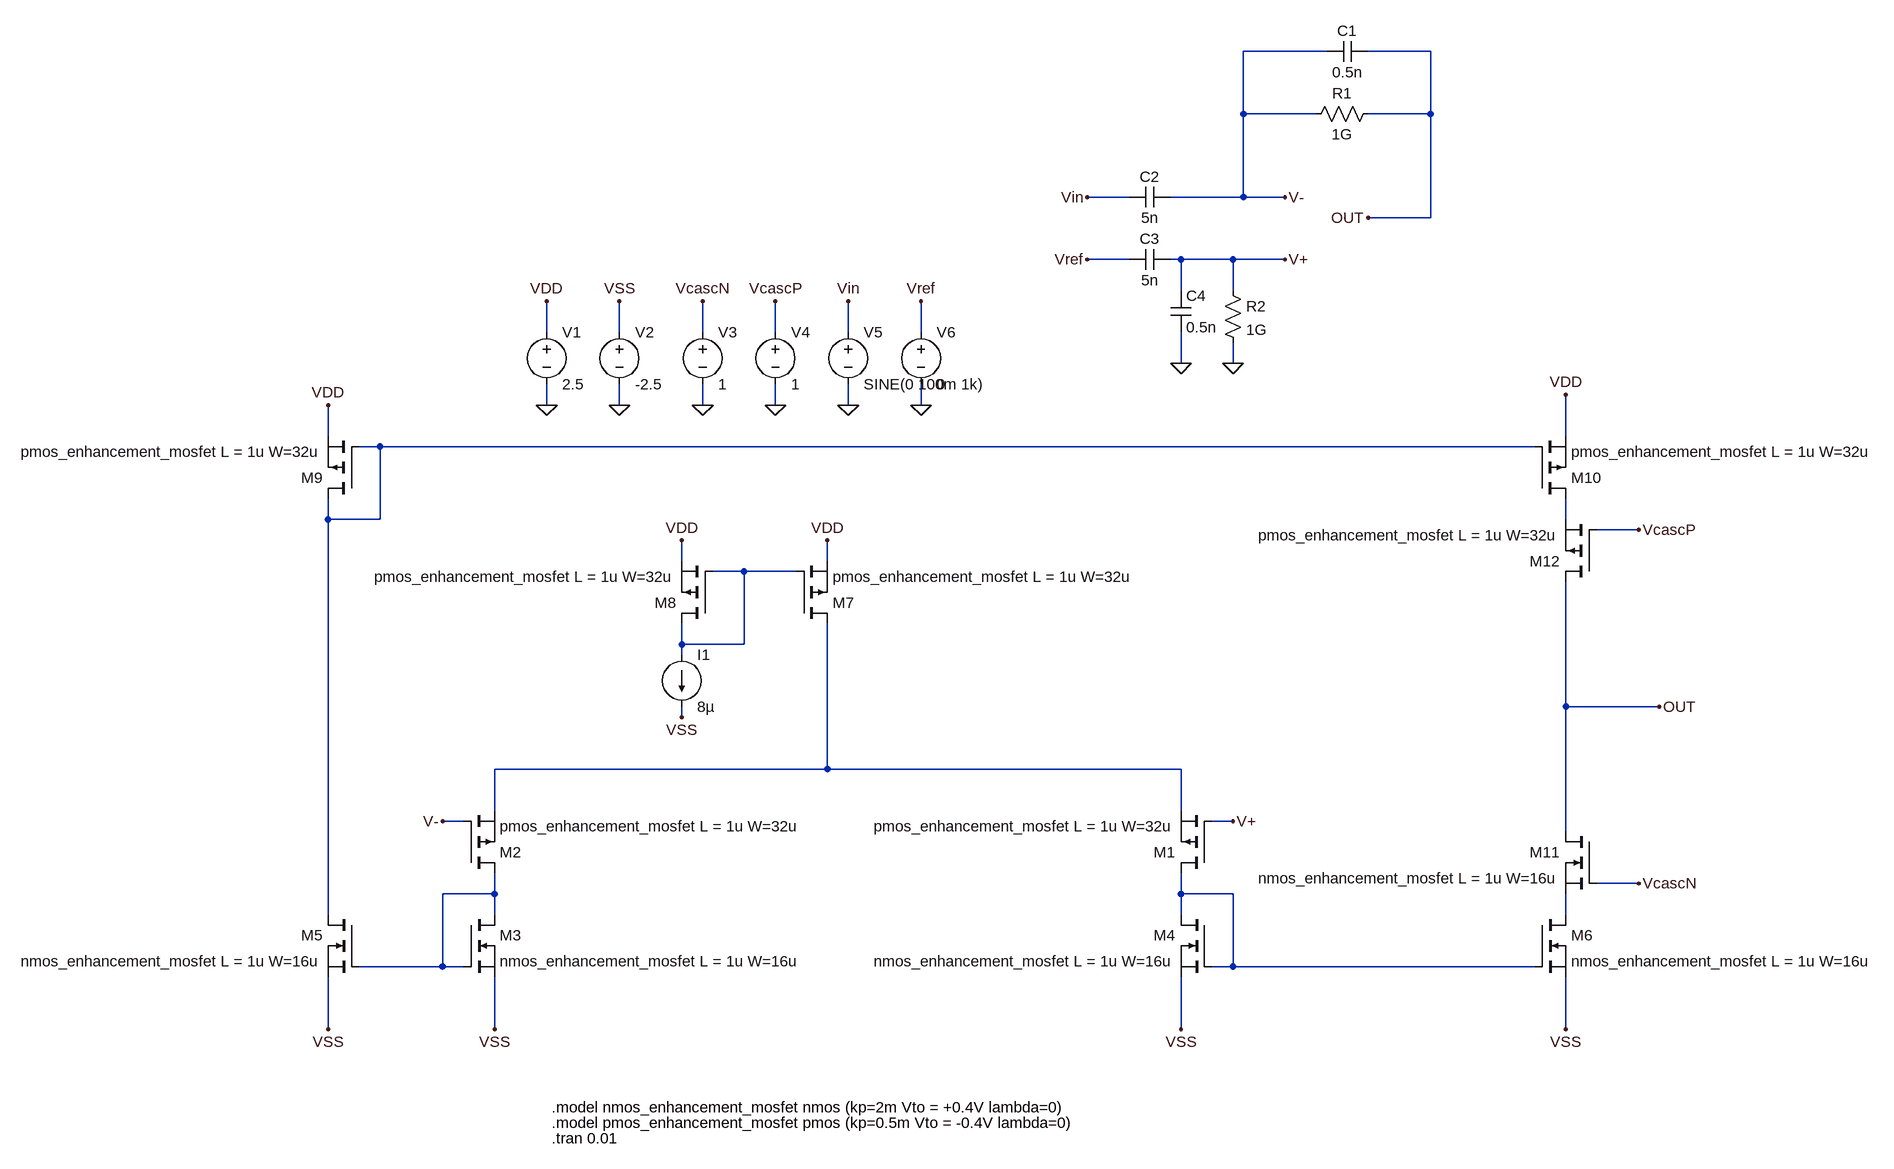
[diagram p0: schematic LTSPICEMOSFET.asc]
LTSPICEMOSFET.asc, the LTspice schematic file:
Version 4
SHEET 1 1460 680
WIRE 576 -1440 448 -1440
WIRE 736 -1440 640 -1440
WIRE 448 -1344 448 -1440
WIRE 560 -1344 448 -1344
WIRE 736 -1344 736 -1440
WIRE 736 -1344 640 -1344
WIRE 272 -1216 208 -1216
WIRE 448 -1216 448 -1344
WIRE 448 -1216 336 -1216
WIRE 512 -1216 448 -1216
WIRE 736 -1184 736 -1344
WIRE 736 -1184 640 -1184
WIRE 272 -1120 208 -1120
WIRE 352 -1120 336 -1120
WIRE 432 -1120 352 -1120
WIRE 512 -1120 432 -1120
WIRE 352 -1072 352 -1120
WIRE 432 -1072 432 -1120
WIRE -624 -1008 -624 -1056
WIRE -512 -1008 -512 -1056
WIRE -384 -1008 -384 -1056
WIRE -272 -1008 -272 -1056
WIRE -160 -1008 -160 -1056
WIRE -48 -1008 -48 -1056
WIRE 352 -960 352 -1008
WIRE 432 -960 432 -992
WIRE -624 -896 -624 -928
WIRE -512 -896 -512 -928
WIRE -384 -896 -384 -928
WIRE -272 -896 -272 -928
WIRE -160 -896 -160 -928
WIRE -48 -896 -48 -928
WIRE -960 -848 -960 -896
WIRE 944 -848 944 -912
WIRE -880 -832 -912 -832
WIRE 896 -832 -880 -832
WIRE -960 -720 -960 -752
WIRE -880 -720 -880 -832
WIRE -880 -720 -960 -720
WIRE 944 -720 944 -752
WIRE 1056 -704 992 -704
WIRE -416 -656 -416 -688
WIRE -192 -656 -192 -688
WIRE -320 -640 -368 -640
WIRE -240 -640 -320 -640
WIRE -416 -528 -416 -560
WIRE -320 -528 -320 -640
WIRE -320 -528 -416 -528
WIRE -416 -512 -416 -528
WIRE 944 -432 944 -624
WIRE 1088 -432 944 -432
WIRE -416 -416 -416 -432
WIRE -192 -336 -192 -560
WIRE -192 -336 -704 -336
WIRE 352 -336 -192 -336
WIRE -704 -272 -704 -336
WIRE 352 -272 352 -336
WIRE -752 -256 -784 -256
WIRE 432 -256 400 -256
WIRE 944 -240 944 -432
WIRE 1056 -160 992 -160
WIRE -704 -144 -704 -176
WIRE -704 -144 -784 -144
WIRE 352 -144 352 -176
WIRE 432 -144 352 -144
WIRE -960 -112 -960 -720
WIRE -704 -112 -704 -144
WIRE 352 -112 352 -144
WIRE 944 -112 944 -144
WIRE -784 -32 -784 -144
WIRE -784 -32 -912 -32
WIRE -752 -32 -784 -32
WIRE 432 -32 432 -144
WIRE 432 -32 400 -32
WIRE 896 -32 432 -32
WIRE -960 64 -960 -16
WIRE -704 64 -704 -16
WIRE 352 64 352 -16
WIRE 944 64 944 -16
FLAG -704 64 VSS
FLAG 352 64 VSS
FLAG -960 64 VSS
FLAG 944 64 VSS
FLAG -192 -688 VDD
FLAG -416 -688 VDD
FLAG -416 -416 VSS
FLAG -960 -896 VDD
FLAG 1056 -160 VcascN
FLAG 1056 -704 VcascP
FLAG 944 -912 VDD
FLAG 432 -256 V+
FLAG -784 -256 V-
FLAG -624 -896 0
FLAG -512 -896 0
FLAG -624 -1056 VDD
FLAG -512 -1056 VSS
FLAG -384 -896 0
FLAG -272 -896 0
FLAG -384 -1056 VcascN
FLAG -272 -1056 VcascP
FLAG 1088 -432 OUT
FLAG -160 -896 0
FLAG -48 -896 0
FLAG 512 -1216 V-
FLAG 512 -1120 V+
FLAG 640 -1184 OUT
FLAG 432 -960 0
FLAG 352 -960 0
FLAG 208 -1216 Vin
FLAG 208 -1120 Vref
FLAG -160 -1056 Vin
FLAG -48 -1056 Vref
SYMBOL pmos 400 -176 R180
SYMATTR InstName M1
SYMATTR Value pmos_enhancement_mosfet L = 1u W=32u
SYMBOL nmos -752 -112 R0
SYMATTR InstName M3
SYMATTR Value nmos_enhancement_mosfet L = 1u W=16u
SYMBOL pmos -752 -176 M180
SYMATTR InstName M2
SYMATTR Value pmos_enhancement_mosfet L = 1u W=32u
SYMBOL nmos 400 -112 M0
SYMATTR InstName M4
SYMATTR Value nmos_enhancement_mosfet L = 1u W=16u
SYMBOL nmos -912 -112 M0
SYMATTR InstName M5
SYMATTR Value nmos_enhancement_mosfet L = 1u W=16u
SYMBOL nmos 896 -112 R0
SYMATTR InstName M6
SYMATTR Value nmos_enhancement_mosfet L = 1u W=16u
SYMBOL pmos -240 -560 M180
SYMATTR InstName M7
SYMATTR Value pmos_enhancement_mosfet L = 1u W=32u
SYMBOL pmos -368 -560 R180
SYMATTR InstName M8
SYMATTR Value pmos_enhancement_mosfet L = 1u W=32u
SYMBOL current -416 -512 R0
WINDOW 123 0 0 Left 0
WINDOW 39 0 0 Left 0
SYMATTR InstName I1
SYMATTR Value 8µ
SYMBOL pmos -912 -752 R180
SYMATTR InstName M9
SYMATTR Value pmos_enhancement_mosfet L = 1u W=32u
SYMBOL pmos 896 -752 M180
SYMATTR InstName M10
SYMATTR Value pmos_enhancement_mosfet L = 1u W=32u
SYMBOL nmos 992 -240 M0
SYMATTR InstName M11
SYMATTR Value nmos_enhancement_mosfet L = 1u W=16u
SYMBOL pmos 992 -624 R180
SYMATTR InstName M12
SYMATTR Value pmos_enhancement_mosfet L = 1u W=32u
SYMBOL voltage -624 -1024 R0
WINDOW 123 0 0 Left 0
WINDOW 39 0 0 Left 0
SYMATTR InstName V1
SYMATTR Value 2.5
SYMBOL voltage -512 -1024 R0
WINDOW 123 0 0 Left 0
WINDOW 39 0 0 Left 0
SYMATTR InstName V2
SYMATTR Value -2.5
SYMBOL voltage -384 -1024 R0
WINDOW 123 0 0 Left 0
WINDOW 39 0 0 Left 0
SYMATTR InstName V3
SYMATTR Value 1
SYMBOL voltage -272 -1024 R0
WINDOW 123 0 0 Left 0
WINDOW 39 0 0 Left 0
SYMATTR InstName V4
SYMATTR Value 1
SYMBOL voltage -160 -1024 R0
WINDOW 123 0 0 Left 0
WINDOW 39 0 0 Left 0
SYMATTR InstName V5
SYMATTR Value SINE(0 100m 1k)
SYMBOL voltage -48 -1024 R0
WINDOW 123 0 0 Left 0
WINDOW 39 0 0 Left 0
SYMATTR InstName V6
SYMATTR Value 0
SYMBOL res 656 -1360 R90
WINDOW 0 0 56 VBottom 2
WINDOW 3 32 56 VTop 2
SYMATTR InstName R1
SYMATTR Value 1G
SYMBOL cap 640 -1456 R90
WINDOW 0 0 32 VBottom 2
WINDOW 3 32 32 VTop 2
SYMATTR InstName C1
SYMATTR Value 0.5n
SYMBOL cap 336 -1232 R90
WINDOW 0 0 32 VBottom 2
WINDOW 3 32 32 VTop 2
SYMATTR InstName C2
SYMATTR Value 5n
SYMBOL cap 336 -1136 R90
WINDOW 0 0 32 VBottom 2
WINDOW 3 32 32 VTop 2
SYMATTR InstName C3
SYMATTR Value 5n
SYMBOL cap 336 -1072 R0
SYMATTR InstName C4
SYMATTR Value 0.5n
SYMBOL res 416 -1088 R0
SYMATTR InstName R2
SYMATTR Value 1G
TEXT -616 184 Left 2 !.model nmos_enhancement_mosfet nmos (kp=2m Vto = +0.4V lambda=0)
TEXT -616 208 Left 2 !.model pmos_enhancement_mosfet pmos (kp=0.5m Vto = -0.4V lambda=0)
TEXT -616 232 Left 2 !.tran 0.01

The netlist it stands for:
* LTSPICEMOSFET.asc
M1 N006 V+ N004 N004 pmos_enhancement_mosfet L = 1u W=32u
M3 N005 N005 VSS VSS nmos_enhancement_mosfet L = 1u W=16u
M2 N005 V- N004 N004 pmos_enhancement_mosfet L = 1u W=32u
M4 N006 N006 VSS VSS nmos_enhancement_mosfet L = 1u W=16u
M5 N001 N005 VSS VSS nmos_enhancement_mosfet L = 1u W=16u
M6 N007 N006 VSS VSS nmos_enhancement_mosfet L = 1u W=16u
M7 N004 N003 VDD VDD pmos_enhancement_mosfet L = 1u W=32u
M8 N003 N003 VDD VDD pmos_enhancement_mosfet L = 1u W=32u
I1 N003 VSS 8µ
M9 N001 N001 VDD VDD pmos_enhancement_mosfet L = 1u W=32u
M10 N002 N001 VDD VDD pmos_enhancement_mosfet L = 1u W=32u
M11 OUT VcascN N007 N007 nmos_enhancement_mosfet L = 1u W=16u
M12 OUT VcascP N002 N002 pmos_enhancement_mosfet L = 1u W=32u
V1 VDD 0 2.5
V2 VSS 0 -2.5
V3 VcascN 0 1
V4 VcascP 0 1
V5 Vin 0 SINE(0 100m 1k)
V6 Vref 0 0
R1 OUT V- 1G
C1 OUT V- 0.5n
C2 V- Vin 5n
C3 V+ Vref 5n
C4 V+ 0 0.5n
R2 V+ 0 1G
.model NMOS NMOS
.model PMOS PMOS
.lib standard.mos
.model nmos_enhancement_mosfet nmos (kp=2m Vto = +0.4V lambda=0)
.model pmos_enhancement_mosfet pmos (kp=0.5m Vto = -0.4V lambda=0)
.tran 0.01
.backanno
.end